# EAGLE design Prototyping OTG Board (EAGLE 5.11)
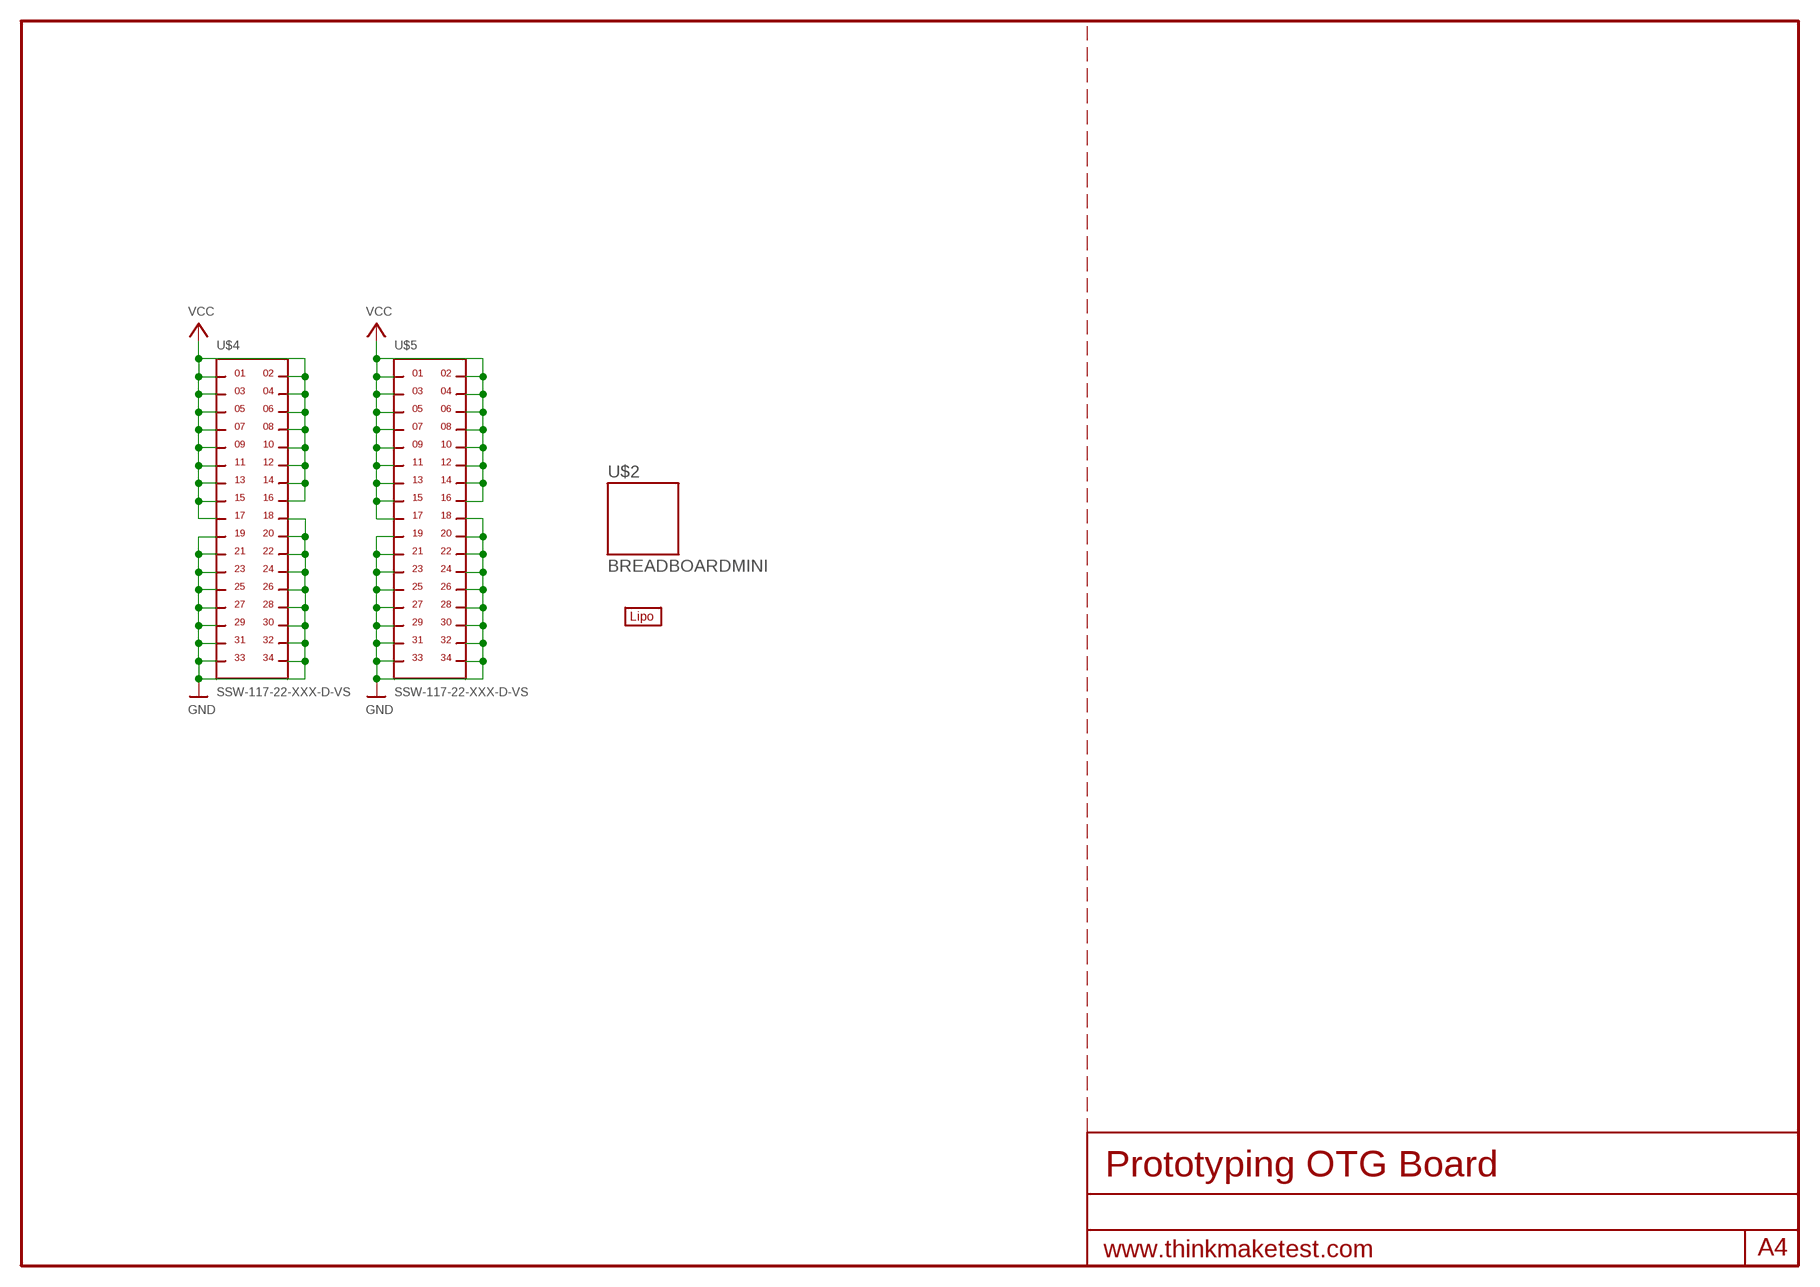
[diagram p0: schematic, sheet 1]

## Parts
U$2  BREADBOARDMINI  [BREADBOARD-MINI]
U$3  LIPO-OUTLINE2000  [LIPO-2000]
U$4  SSW-117-22-XXX-D-VS  [SSW-117-22-XXX-D-VS]
U$5  SSW-117-22-XXX-D-VS  [SSW-117-22-XXX-D-VS]

## Nets
GND: U$4.18 U$4.19 U$4.20 U$4.21 U$4.22 U$4.23 U$4.24 U$4.25 U$4.26 U$4.27 U$4.28 U$4.29 U$4.30 U$4.31 U$4.32 U$4.33 U$4.34 U$5.18 U$5.19 U$5.20 U$5.21 U$5.22 U$5.23 U$5.24 U$5.25 U$5.26 U$5.27 U$5.28 U$5.29 U$5.30 U$5.31 U$5.32 U$5.33 U$5.34
VCC: U$4.1 U$4.2 U$4.3 U$4.4 U$4.5 U$4.6 U$4.7 U$4.8 U$4.9 U$4.10 U$4.11 U$4.12 U$4.13 U$4.14 U$4.15 U$4.16 U$4.17 U$5.1 U$5.2 U$5.3 U$5.4 U$5.5 U$5.6 U$5.7 U$5.8 U$5.9 U$5.10 U$5.11 U$5.12 U$5.13 U$5.14 U$5.15 U$5.16 U$5.17

## Library data of the parts
U$2 = SparkFun:BREADBOARD: Breadboard Mini Self Adhesive This is the mechnical outline for the very small self adhesive breadboard from SparkFun Electronics. Good for very small proto areas. SKU : PRT-07916
U$3 = SparkFun:LIPO-OUTLINE
U$4 U$5 = samtec:SSW-117-22-XXX-D-VS

## Board
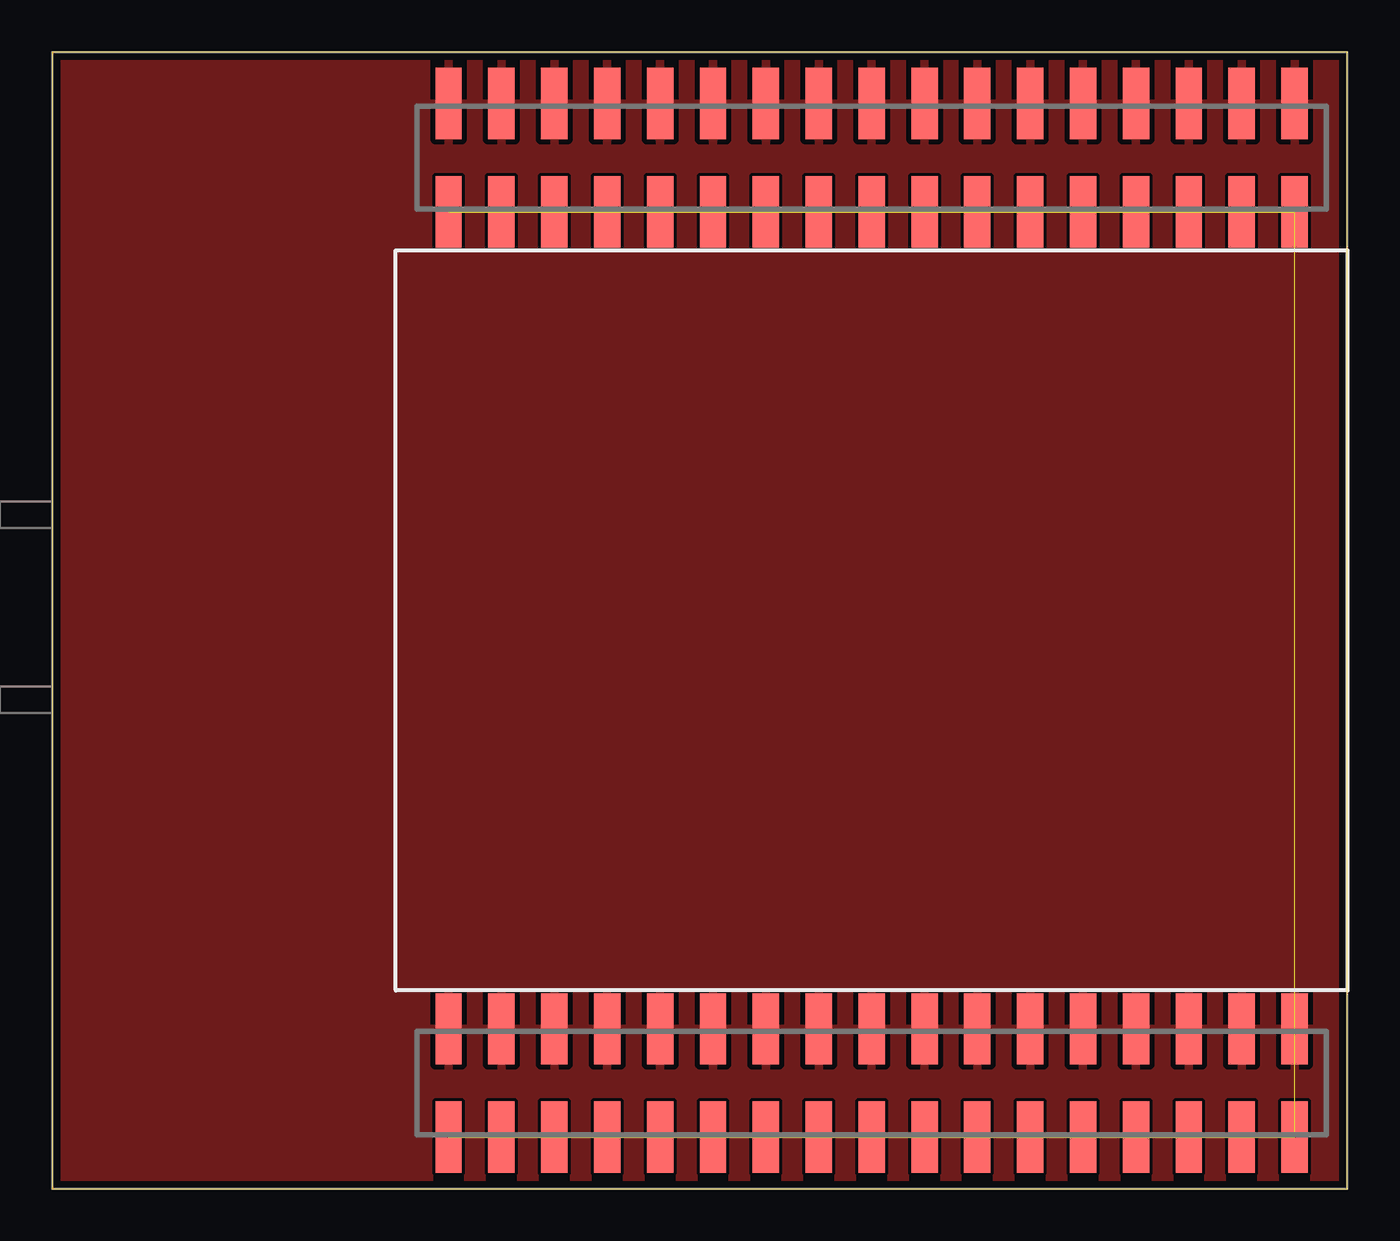
[diagram p1: board, top side]
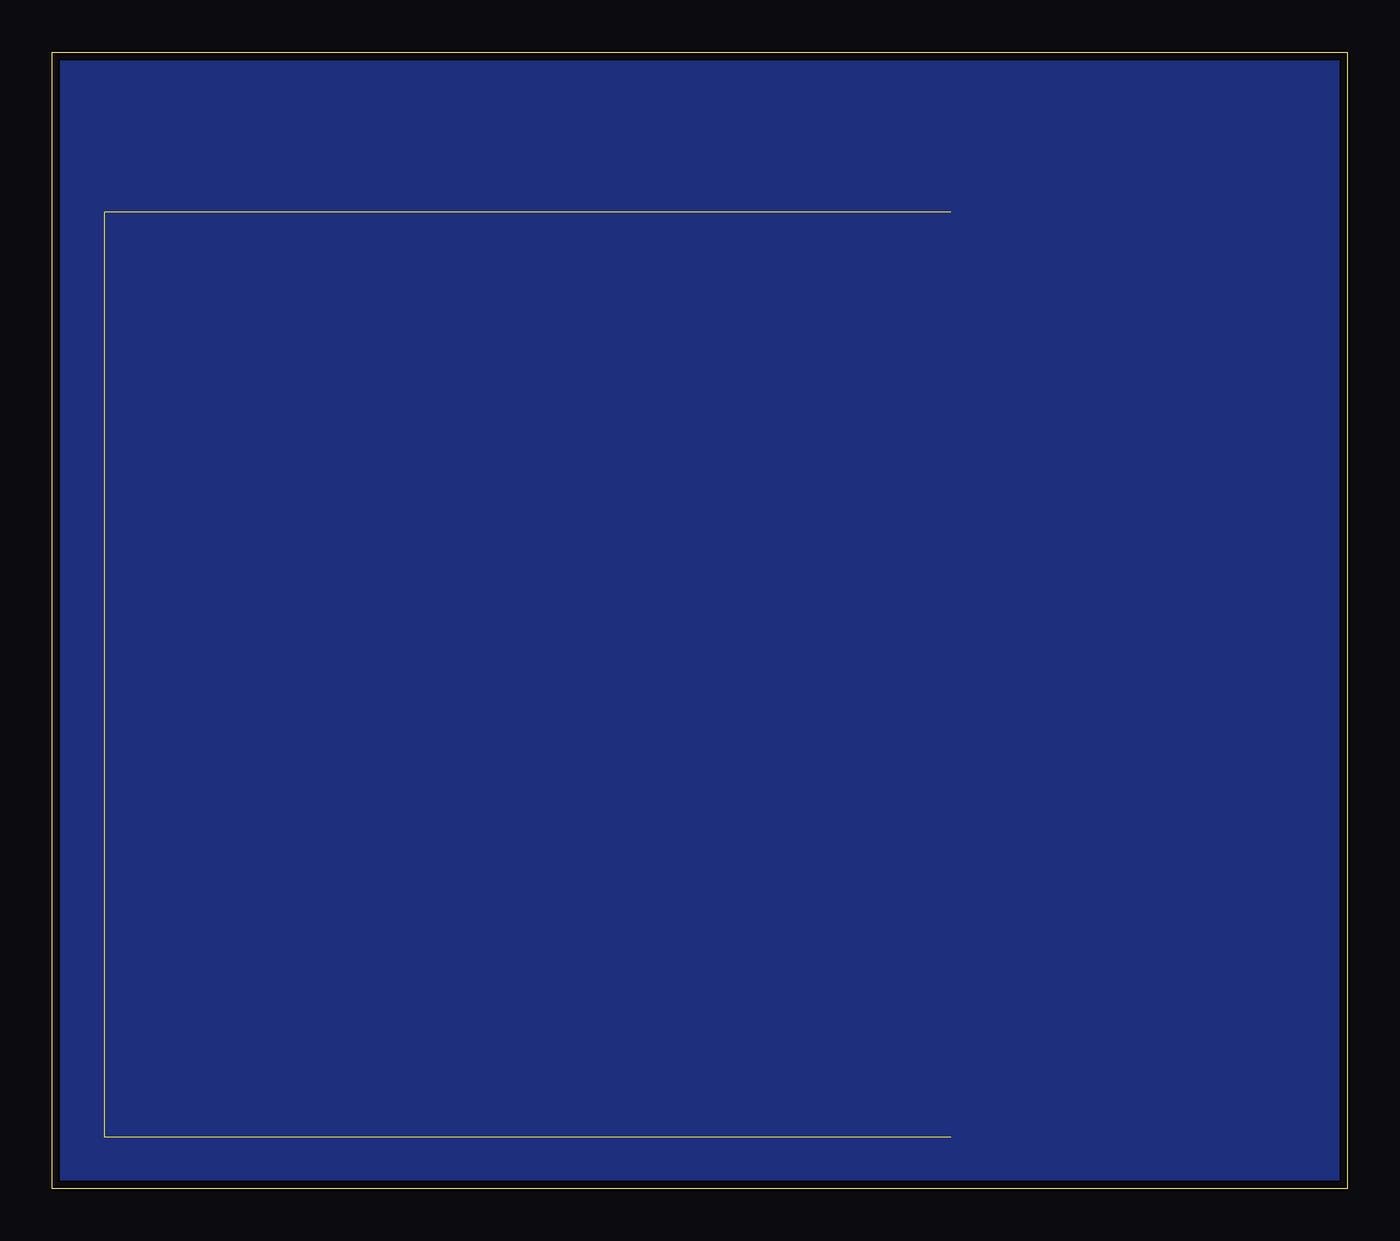
[diagram p2: board, bottom side, seen from below]

Size 62.23 x 54.61 mm. Coordinates in mm from the lower left corner, seen from the top.
Outline: 0,0 62.23,0 62.23,54.61 0,54.61 0,0
Copper layers (1*16): Top 0.0356mm / dielectric 1.5011mm / Bottom 0.0356mm
Design rules "LaenPCBOrder": minimum track width 6mil, minimum drill 13mil, track to track 6mil, track to pad 6mil, pad to pad 6mil, via to via 6mil, smd to smd 6mil, copper to edge 15mil, drill to drill 6mil, minimum pad ring 7mil, minimum via ring 7mil, stop-mask expansion 4mil, vias tented up to drill 0mil, thermal gap 10mil

### Footprints (pad centres in the part's own frame; a part is rotated, then mirrored left to right if it is on the bottom)
SSW-117-22-XXX-D-VS = smd 1.27 x 3.429: 1 -2.54,-2.603; 2 0,-2.603; 3 -5.08,-2.603; 4 2.54,-2.603; 5 -7.62,-2.603; 6 5.08,-2.603; 7 -10.16,-2.603; 8 7.62,-2.603; 9 -12.7,-2.603; 10 10.16,-2.603; 11 -15.24,-2.603; 12 12.7,-2.603; 13 -17.78,-2.603; 14 15.24,-2.603; 15 -20.32,-2.603; 16 17.78,-2.603; 17 20.32,-2.603; 18 2.54,2.603; 19 0,2.603; 20 5.08,2.603; 21 -2.54,2.603; 22 7.62,2.603; 23 -5.08,2.603; 24 10.16,2.603; 25 -7.62,2.603; 26 12.7,2.603; 27 -10.16,2.603; 28 15.24,2.603; 29 -12.7,2.603; 30 17.78,2.603; 31 -15.24,2.603; 32 20.32,2.603; 33 -17.78,2.603; 34 -20.32,2.603

### Placement (x,y rotation side)
U$2  16.51,9.53 0 top
U$3  0,0 0 top
U$4  39.37,49.53 0 top
U$5  39.37,5.08 0 top

### Tracks (layer width: path | path; a pad name or v marks a point on that pad's centre or on a via)
GND
  pour Bottom: 0,54.61 62.23,54.61 62.23,0 0,0
  pour Top: 0,54.61 62.23,54.61 62.23,0 0,0
VCC  (33 unrouted)